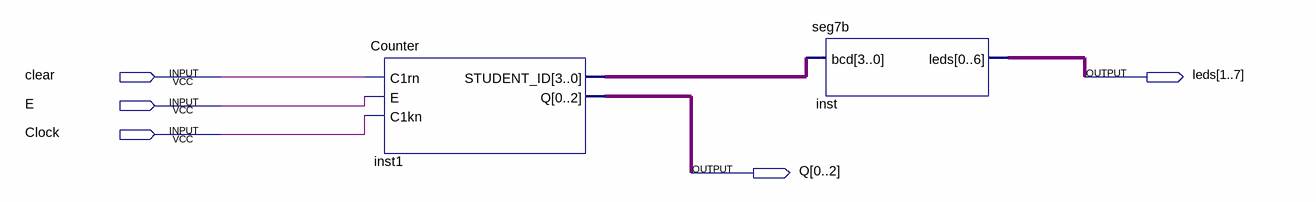
[diagram p0: schematic sheet]
// Quartus schematic FGBA.bdf as structural Verilog: 2 symbols, 5 pins
module FGBA (
  input  clear,
  input  E,
  input  Clock,
  output [1:7] leds,
  output [0:2] Q
);

  wire [3:0] inst1_student_id;

  Counter inst1 (.C1rn(clear), .E(E), .C1kn(Clock), .STUDENT_ID(inst1_student_id), .Q(Q));
  seg7b inst (.bcd(inst1_student_id), .leds(leds));
endmodule
